# Altium schematic sheet msp430_sch.SchDoc
size A
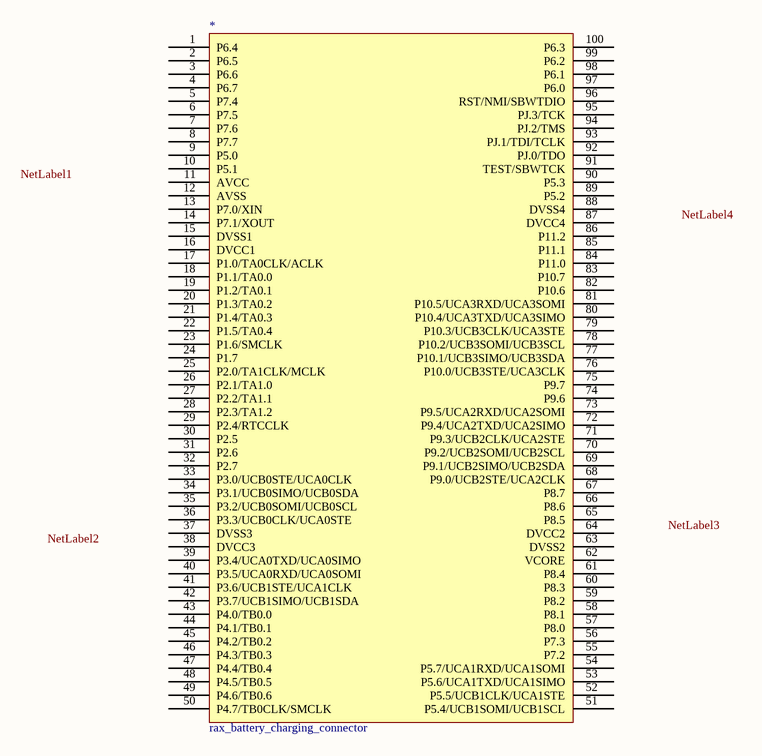
[diagram p0: msp430_sch.SchDoc]

## Parts
*  rax_battery_charging_connector  [SQFP50P1600X1600-100L]

## Nets

Not connected (* = marked no-connect by the designer): * 1(P6.4) 2(P6.5) 3(P6.6) 4(P6.7) 5(P7.4) 6(P7.5) 7(P7.6) 8(P7.7) 9(P5.0) 10(P5.1) 11(AVCC) 12(AVSS) 13(P7.0/XIN) 14(P7.1/XOUT) 15(DVSS1) 16(DVCC1) 17(P1.0/TA0CLK/ACLK) 18(P1.1/TA0.0) 19(P1.2/TA0.1) 20(P1.3/TA0.2) 21(P1.4/TA0.3) 22(P1.5/TA0.4) 23(P1.6/SMCLK) 24(P1.7) 25(P2.0/TA1CLK/MCLK) 26(P2.1/TA1.0) 27(P2.2/TA1.1) 28(P2.3/TA1.2) 29(P2.4/RTCCLK) 30(P2.5) 31(P2.6) 32(P2.7) 33(P3.0/UCB0STE/UCA0CLK) 34(P3.1/UCB0SIMO/UCB0SDA) 35(P3.2/UCB0SOMI/UCB0SCL) 36(P3.3/UCB0CLK/UCA0STE) 37(DVSS3) 38(DVCC3) 39(P3.4/UCA0TXD/UCA0SIMO) 40(P3.5/UCA0RXD/UCA0SOMI) 41(P3.6/UCB1STE/UCA1CLK) 42(P3.7/UCB1SIMO/UCB1SDA) 43(P4.0/TB0.0) 44(P4.1/TB0.1) 45(P4.2/TB0.2) 46(P4.3/TB0.3) 47(P4.4/TB0.4) 48(P4.5/TB0.5) 49(P4.6/TB0.6) 50(P4.7/TB0CLK/SMCLK) 51(P5.4/UCB1SOMI/UCB1SCL) 52(P5.5/UCB1CLK/UCA1STE) 53(P5.6/UCA1TXD/UCA1SIMO) 54(P5.7/UCA1RXD/UCA1SOMI) 55(P7.2) 56(P7.3) 57(P8.0) 58(P8.1) 59(P8.2) 60(P8.3) 61(P8.4) 62(VCORE) 63(DVSS2) 64(DVCC2) 65(P8.5) 66(P8.6) 67(P8.7) 68(P9.0/UCB2STE/UCA2CLK) 69(P9.1/UCB2SIMO/UCB2SDA) 70(P9.2/UCB2SOMI/UCB2SCL) 71(P9.3/UCB2CLK/UCA2STE) 72(P9.4/UCA2TXD/UCA2SIMO) 73(P9.5/UCA2RXD/UCA2SOMI) 74(P9.6) 75(P9.7) 76(P10.0/UCB3STE/UCA3CLK) 77(P10.1/UCB3SIMO/UCB3SDA) 78(P10.2/UCB3SOMI/UCB3SCL) 79(P10.3/UCB3CLK/UCA3STE) 80(P10.4/UCA3TXD/UCA3SIMO) 81(P10.5/UCA3RXD/UCA3SOMI) 82(P10.6) 83(P10.7) 84(P11.0) 85(P11.1) 86(P11.2) 87(DVCC4) 88(DVSS4) 89(P5.2) 90(P5.3) 91(TEST/SBWTCK) 92(PJ.0/TDO) 93(PJ.1/TDI/TCLK) 94(PJ.2/TMS) 95(PJ.3/TCK) 96(RST/NMI/SBWTDIO) 97(P6.0) 98(P6.1) 99(P6.2) 100(P6.3)

## Notes on the sheet
- Labels drawn without touching a wire or pin: NetLabel1, NetLabel2, NetLabel3, NetLabel4

## Library data of the parts
* = MSP430F438IPZ